# EAGLE board circadian rev2.0 (EAGLE 9.5.1), part 1 of 2
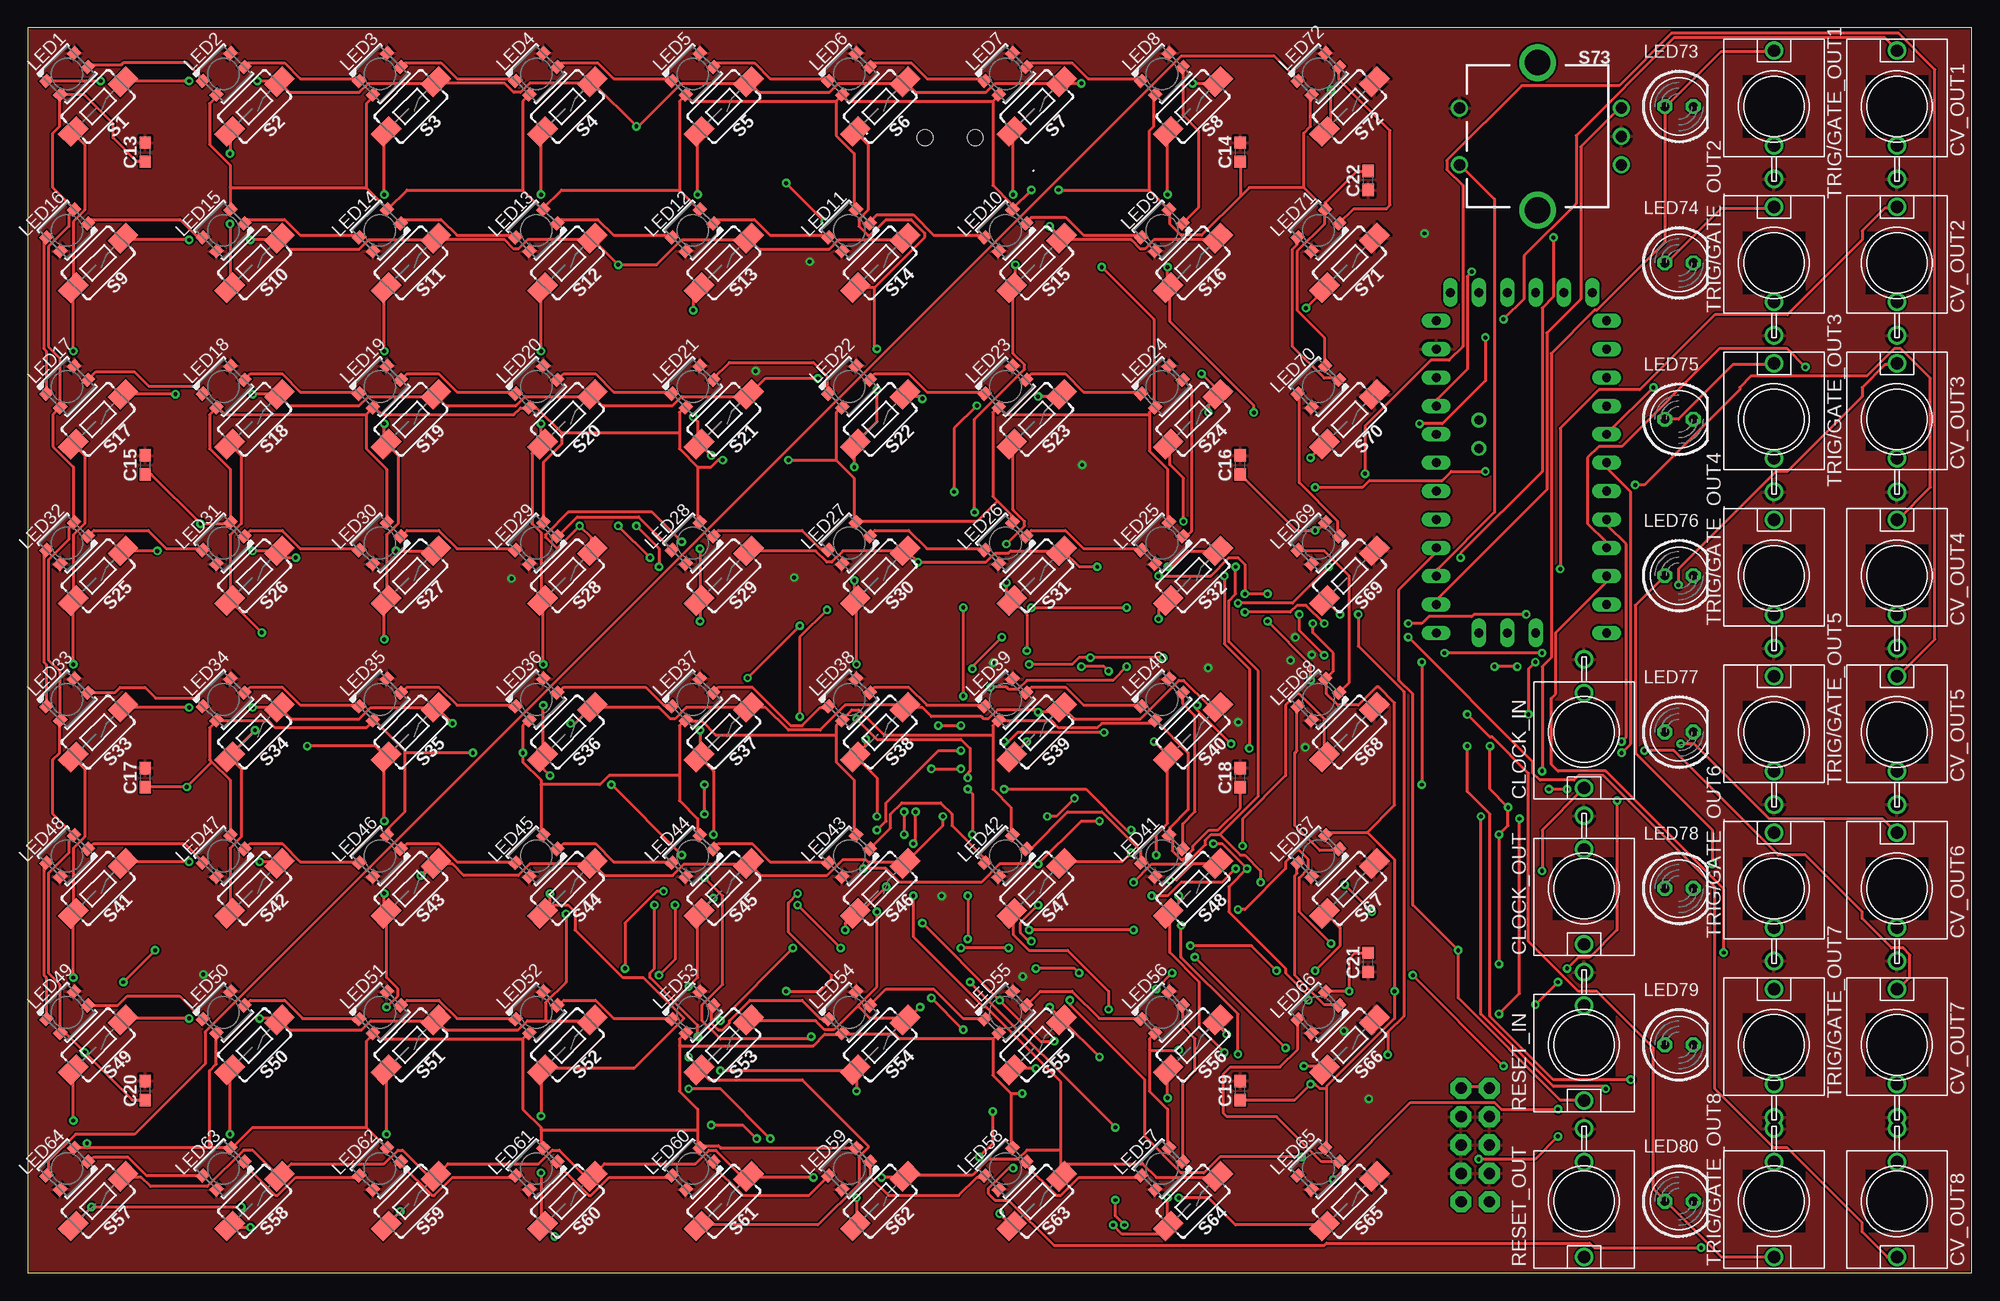
[diagram p6: board, top side]
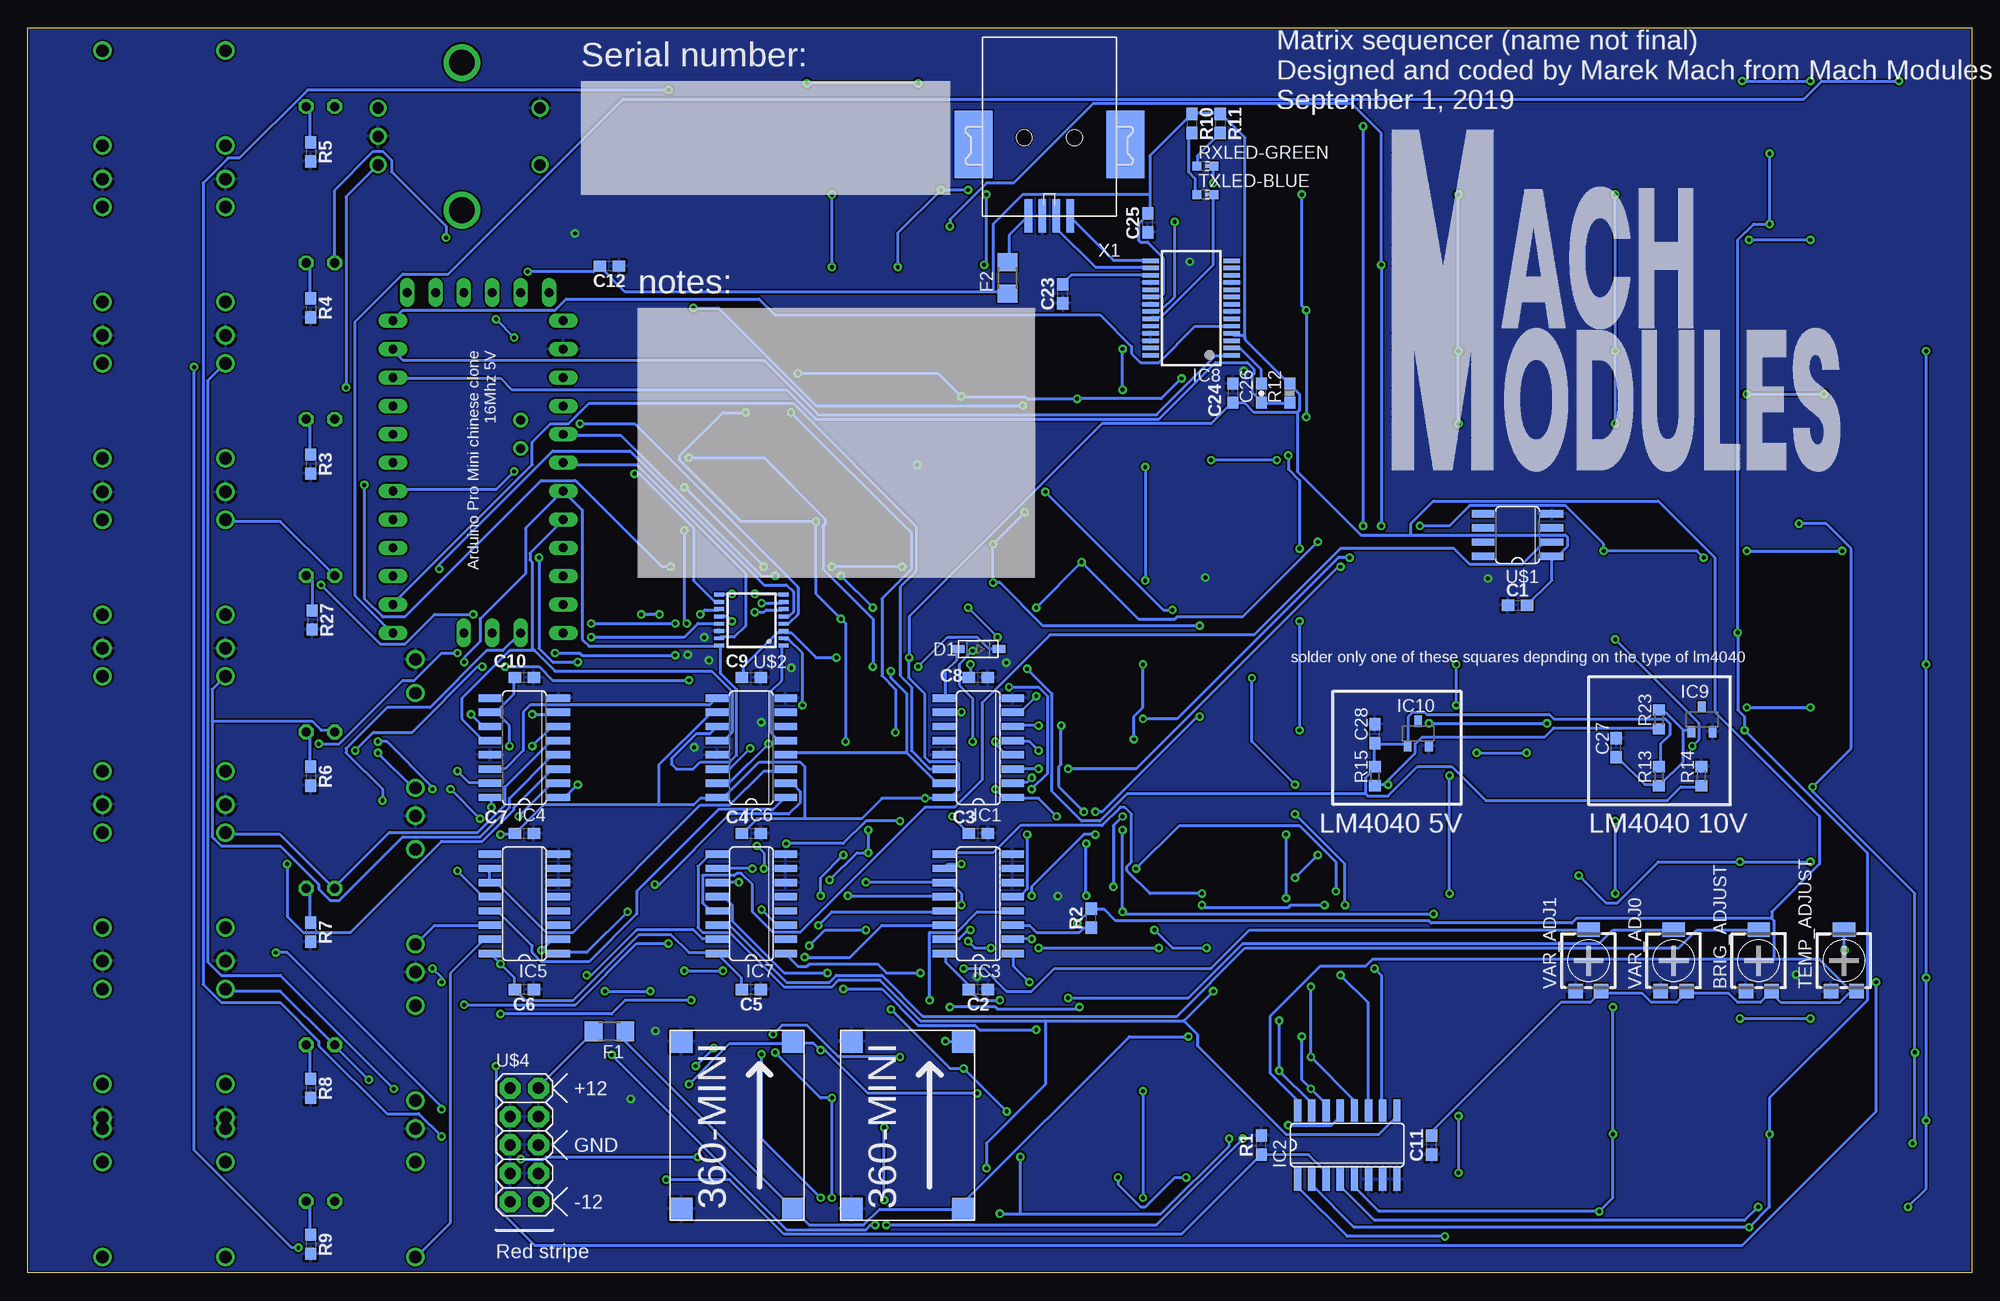
[diagram p7: board, bottom side, seen from below]

Size 173.97 x 111.43 mm. Coordinates in mm from the lower left corner, seen from the top.
Outline: 0,0 173.97,0 173.97,111.43 0,111.43 0,0
Copper layers (1*16): Top 0.035mm / dielectric 0.15mm / Bottom 0.035mm
Design rules "default *": minimum track width 6mil, minimum drill 0.35mm, track to track 6mil, track to pad 6mil, pad to pad 6mil, via to via 6mil, smd to smd 6mil, copper to edge 6mil, drill to drill 6mil, minimum pad ring 10mil, minimum via ring 8mil, stop-mask expansion 4mil, vias tented up to drill 50mil, thermal gap 10mil
Net classes: 0 default: width 0.254 mm; 1 LED_POWER: width 0.305 mm

## Footprints (pad centres in the part's own frame; a part is rotated, then mirrored left to right if it is on the bottom)
RTRIM4G/J = smd 1.3 x 1.3: 1 -1.15,-2.75; 3 1.15,-2.75 | smd 2 x 1.3: 2 0,2.75
0603 = smd 1.1 x 1: 1 -0.85,0; 2 0.85,0
0603-CAP = smd 1.1 x 1: 1 -0.85,0; 2 0.85,0
C0603 = smd 1.1 x 1: 1 -0.85,0; 2 0.85,0
WQP-PJ301M-12_JACK = drill 1.1: P$1 0,5; P$2 0,-3.5; P$3 0,-6.5
SOD-123 = smd 1.2 x 0.7: A 1.85,0; C -1.85,0
1206 = smd 1.6 x 1.803: 1 -1.422,0; 2 1.422,0
SO16 = smd 0.66 x 2.032: 1 -4.445,-3.073; 2 -3.175,-3.073; 3 -1.905,-3.073; 4 -0.635,-3.073; 5 0.635,-3.073; 6 1.905,-3.073; 7 3.175,-3.073; 8 4.445,-3.073; 9 4.445,3.073; 10 3.175,3.073; 11 1.905,3.073; 12 0.635,3.073; 13 -0.635,3.073; 14 -1.905,3.073; 15 -3.175,3.073; 16 -4.445,3.073
SSOP28 = smd 0.4 x 1.5: 1 -4.225,-3.625; 2 -3.575,-3.625; 3 -2.925,-3.625; 4 -2.275,-3.625; 5 -1.625,-3.625; 6 -0.975,-3.625; 7 -0.325,-3.625; 8 0.325,-3.625; 9 0.975,-3.625; 10 1.625,-3.625; 11 2.275,-3.625; 12 2.925,-3.625; 13 3.575,-3.625; 14 4.225,-3.625; 15 4.225,3.625; 16 3.575,3.625; 17 2.925,3.625; 18 2.275,3.625; 19 1.625,3.625; 20 0.975,3.625; 21 0.325,3.625; 22 -0.325,3.625; 23 -0.975,3.625; 24 -1.625,3.625; 25 -2.275,3.625; 26 -2.925,3.625; 27 -3.575,3.625; 28 -4.225,3.625
DBZ_R-PDSO-G3 = smd 0.7 x 1: 1 -0.95,-1.1; 2 0.95,-1.1; 3 0,1.1
LED3535 = smd 1 x 0.85: 1 -1.75,0.875; 2 -1.75,-0.875; 3 1.75,-0.875; 4 1.75,0.875
LED5MM = drill 0.813 octagon: A -1.27,0; K 1.27,0
0603-RES = smd 1.1 x 1: 1 -0.85,0; 2 0.85,0
R0603 = smd 1 x 1.1: 1 -0.85,0; 2 0.85,0
CHIP-LED0603 = smd 0.8 x 0.8: A 0,-0.75; C 0,0.75
TACTILE_SWITCH_SMD_6.0X3.5MM = smd 2.3 x 1.6: 1 -3.15,0; 2 3.15,0
ROTARY_ENC_PLAIN = drill 1.016: A 7.493,-2.54; B 7.493,2.54; C 7.493,0; SW+ -6.985,2.54; SW- -6.985,-2.54 | drill 2.286: P$3 0,6.604; P$4 0,-6.604
SO08 = smd 0.66 x 2.032: 1 -1.905,-3.073; 2 -0.635,-3.073; 3 0.635,-3.073; 4 1.905,-3.073; 5 1.905,3.073; 6 0.635,3.073; 7 -0.635,3.073; 8 -1.905,3.073
TSSOP-16 = smd 0.9 x 0.35: 1 -2.875,2.275; 2 -2.875,1.625; 3 -2.875,0.975; 4 -2.875,0.325; 5 -2.875,-0.325; 6 -2.875,-0.975; 7 -2.875,-1.625; 8 -2.875,-2.275; 9 2.875,-2.275; 10 2.875,-1.625; 11 2.875,-0.975; 12 2.875,-0.325; 13 2.875,0.325; 14 2.875,0.975; 15 2.875,1.625; 16 2.875,2.275
ABK-PRO-MINI = drill 0.8 long: A0 10.16,-11.43; A1 10.16,-8.89; A2 10.16,-6.35; A3 10.16,-3.81; A6 3.81,-21.59; A7 6.35,-21.59; D2 -5.08,-3.81; D3 -5.08,-6.35; D4 -5.08,-8.89; D5 -5.08,-11.43; D6 -5.08,-13.97; D7 -5.08,-16.51; D8 -5.08,-19.05; D9 -5.08,-21.59; D10 10.16,-21.59; D11 10.16,-19.05; D12 10.16,-16.51; D13 10.16,-13.97; DTR -3.81,8.89; GND 10.16,3.81; GND1 -5.08,-1.27; GND2 8.89,8.89; GND3 6.35,8.89; GND4 1.27,-21.59; RAW 10.16,6.35; RST 10.16,1.27; RST1 -5.08,1.27; RX1 -5.08,3.81; RX1-1 1.27,8.89; TX0 -5.08,6.35; TX0-1 -1.27,8.89; VCC 10.16,-1.27; VCC1 3.81,8.89 | drill 0.8: A4 6.35,-5.08; A5 6.35,-2.54
POWER_10 = drill 1.016 pad 1.88 octagon: 1 -5.08,-1.27; 2 -5.08,1.27; 3 -2.54,-1.27; 4 -2.54,1.27; 5 0,-1.27; 6 0,1.27; 7 2.54,-1.27; 8 2.54,1.27; 9 5.08,-1.27; 10 5.08,1.27
MINI-360SMD = smd 2 x 2: +IN -7,-5; +OUT 8,-5; -IN -7,5; -OUT 8,5
USB-B-SMT = smd 6.04 x 3.4: 5 0.58,6.8; 6 0.58,-6.8 | smd 3 x 0.7: D+ 7,1.875; D- 7,0.625; GND 7,-0.625; VUSB 7,-1.875 | hole 1.4: 0,2.25; 0,-2.25

## Placement (x,y rotation side)
BRIG_ADJUST  [RTRIM4G/J]  19.05,27.94 0 bottom
C1  0.1uF  [0603]  40.64,59.75 0 bottom
C2  0.1uF  [0603]  88.9,25.34 180 bottom
C3  0.1uF  [0603]  88.9,39.31 180 bottom
C4  0.1uF  [0603]  109.22,39.31 180 bottom
C5  0.1uF  [0603]  109.22,25.34 180 bottom
C6  0.1uF  [0603]  129.54,25.34 180 bottom
C7  0.1uF  [0603]  129.54,39.31 180 bottom
C8  0.1uF  [0603]  88.9,53.28 180 bottom
C9  0.1uF  [0603]  109.22,53.28 180 bottom
C10  0.1uF  [0603]  129.54,53.28 180 bottom
C11  0.1uF  [0603]  48.32,11.43 90 bottom
C12  0.1uF  [0603]  121.92,90.11 180 bottom
C13  0.1uF  [0603]  10.51,100.31 90 top
C14  0.1uF  [0603]  108.51,100.31 90 top
C15  0.1uF  [0603]  10.51,72.31 90 top
C16  0.1uF  [0603]  108.51,72.31 90 top
C17  0.1uF  [0603]  10.51,44.31 90 top
C18  0.1uF  [0603]  108.51,44.31 90 top
C19  0.1uF  [0603]  108.51,16.31 90 top
C20  0.1uF  [0603]  10.51,16.31 90 top
C21  0.1uF  [0603]  119.97,27.77 90 top
C22  0.1uF  [0603]  119.97,97.77 90 top
C23  0.1uF  [0603]  81.34,87.63 90 bottom
C24  10uF  [0603]  66.1,78.74 90 bottom
C25  0.1uF  [0603]  73.72,93.98 90 bottom
C26  100n  [0603-CAP]  63.56,78.74 90 bottom
C27  470n  [C0603]  31.81,46.99 90 bottom
C28  470n  [C0603]  53.4,48.26 90 bottom
CLOCK_IN  WQP-PJ301M-12_JACK  [WQP-PJ301M-12_JACK]  139.28,48.4 180 top
CLOCK_OUT  WQP-PJ301M-12_JACK  [WQP-PJ301M-12_JACK]  139.28,34.4 180 top
CV_OUT1  WQP-PJ301M-12_JACK  [WQP-PJ301M-12_JACK]  167.29,104.4 0 top
CV_OUT2  WQP-PJ301M-12_JACK  [WQP-PJ301M-12_JACK]  167.29,90.4 0 top
CV_OUT3  WQP-PJ301M-12_JACK  [WQP-PJ301M-12_JACK]  167.29,76.4 0 top
CV_OUT4  WQP-PJ301M-12_JACK  [WQP-PJ301M-12_JACK]  167.29,62.4 0 top
CV_OUT5  WQP-PJ301M-12_JACK  [WQP-PJ301M-12_JACK]  167.29,48.4 0 top
CV_OUT6  WQP-PJ301M-12_JACK  [WQP-PJ301M-12_JACK]  167.29,34.4 0 top
CV_OUT7  WQP-PJ301M-12_JACK  [WQP-PJ301M-12_JACK]  167.29,20.4 0 top
CV_OUT8  WQP-PJ301M-12_JACK  [WQP-PJ301M-12_JACK]  167.29,6.4 180 top
D1  [SOD-123]  88.9,55.82 180 bottom
F1  PTC-FUSE  [1206]  121.92,21.59 180 bottom
F2  PTC-FUSE  [1206]  86.3,89.05 90 bottom
IC1  4017D  [SO16]  88.9,46.99 90 bottom
IC2  4051D  [SO16]  55.88,11.43 0 bottom
IC3  4051D  [SO16]  88.9,33.02 90 bottom
IC4  74HC595D  [SO16]  129.54,46.99 90 bottom
IC5  4053D  [SO16]  129.54,33.02 90 bottom
IC6  74HC595D  [SO16]  109.22,46.99 90 bottom
IC7  4051D  [SO16]  109.22,33.02 90 bottom
IC8  FT232RL  [SSOP28]  69.85,86.36 90 bottom
IC9  LM4040B10  [DBZ_R-PDSO-G3]  24.13,49.53 0 bottom
IC10  LM4040B05  [DBZ_R-PDSO-G3]  49.53,48.26 0 bottom
LED1  WS2812B3535  [LED3535]  3.51,107.31 45 top
LED2  WS2812B3535  [LED3535]  17.51,107.31 45 top
LED3  WS2812B3535  [LED3535]  31.51,107.31 45 top
LED4  WS2812B3535  [LED3535]  45.51,107.31 45 top
LED5  WS2812B3535  [LED3535]  59.51,107.31 45 top
LED6  WS2812B3535  [LED3535]  73.51,107.31 45 top
LED7  WS2812B3535  [LED3535]  87.51,107.31 45 top
LED8  WS2812B3535  [LED3535]  101.51,107.31 45 top
LED9  WS2812B3535  [LED3535]  101.51,93.31 225 top
LED10  WS2812B3535  [LED3535]  87.51,93.31 225 top
LED11  WS2812B3535  [LED3535]  73.51,93.31 225 top
LED12  WS2812B3535  [LED3535]  59.51,93.31 225 top
LED13  WS2812B3535  [LED3535]  45.51,93.31 225 top
LED14  WS2812B3535  [LED3535]  31.51,93.31 225 top
LED15  WS2812B3535  [LED3535]  17.51,93.31 225 top
LED16  WS2812B3535  [LED3535]  3.51,93.31 225 top
LED17  WS2812B3535  [LED3535]  3.51,79.31 45 top
LED18  WS2812B3535  [LED3535]  17.51,79.31 45 top
LED19  WS2812B3535  [LED3535]  31.51,79.31 45 top
LED20  WS2812B3535  [LED3535]  45.51,79.31 45 top
LED21  WS2812B3535  [LED3535]  59.51,79.31 45 top
LED22  WS2812B3535  [LED3535]  73.51,79.31 45 top
LED23  WS2812B3535  [LED3535]  87.51,79.31 45 top
LED24  WS2812B3535  [LED3535]  101.51,79.31 45 top
LED25  WS2812B3535  [LED3535]  101.51,65.31 225 top
LED26  WS2812B3535  [LED3535]  87.51,65.31 225 top
LED27  WS2812B3535  [LED3535]  73.51,65.31 225 top
LED28  WS2812B3535  [LED3535]  59.51,65.31 225 top
LED29  WS2812B3535  [LED3535]  45.51,65.31 225 top
LED30  WS2812B3535  [LED3535]  31.51,65.31 225 top
LED31  WS2812B3535  [LED3535]  17.51,65.31 225 top
LED32  WS2812B3535  [LED3535]  3.51,65.31 225 top
LED33  WS2812B3535  [LED3535]  3.51,51.31 45 top
LED34  WS2812B3535  [LED3535]  17.51,51.31 45 top
LED35  WS2812B3535  [LED3535]  31.51,51.31 45 top
LED36  WS2812B3535  [LED3535]  45.51,51.31 45 top
LED37  WS2812B3535  [LED3535]  59.51,51.31 45 top
LED38  WS2812B3535  [LED3535]  73.51,51.31 45 top
LED39  WS2812B3535  [LED3535]  87.51,51.31 45 top
LED40  WS2812B3535  [LED3535]  101.51,51.31 45 top
LED41  WS2812B3535  [LED3535]  101.51,37.31 225 top
LED42  WS2812B3535  [LED3535]  87.51,37.31 225 top
LED43  WS2812B3535  [LED3535]  73.51,37.31 225 top
LED44  WS2812B3535  [LED3535]  59.51,37.31 225 top
LED45  WS2812B3535  [LED3535]  45.51,37.31 225 top
LED46  WS2812B3535  [LED3535]  31.51,37.31 225 top
LED47  WS2812B3535  [LED3535]  17.51,37.31 225 top
LED48  WS2812B3535  [LED3535]  3.51,37.31 225 top
LED49  WS2812B3535  [LED3535]  3.51,23.31 45 top
LED50  WS2812B3535  [LED3535]  17.51,23.31 45 top
LED51  WS2812B3535  [LED3535]  31.51,23.31 45 top
LED52  WS2812B3535  [LED3535]  45.51,23.31 45 top
LED53  WS2812B3535  [LED3535]  59.51,23.31 45 top
LED54  WS2812B3535  [LED3535]  73.51,23.31 45 top
LED55  WS2812B3535  [LED3535]  87.51,23.31 45 top
LED56  WS2812B3535  [LED3535]  101.51,23.31 45 top
LED57  WS2812B3535  [LED3535]  101.51,9.31 225 top
LED58  WS2812B3535  [LED3535]  87.51,9.31 225 top
LED59  WS2812B3535  [LED3535]  73.51,9.31 225 top
LED60  WS2812B3535  [LED3535]  59.51,9.31 225 top
LED61  WS2812B3535  [LED3535]  45.51,9.31 225 top
LED62  WS2812B3535  [LED3535]  31.51,9.31 225 top
LED63  WS2812B3535  [LED3535]  17.51,9.31 225 top
LED64  WS2812B3535  [LED3535]  3.51,9.31 225 top
LED65  WS2812B3535  [LED3535]  115.51,9.31 225 top
LED66  WS2812B3535  [LED3535]  115.51,23.31 225 top
LED67  WS2812B3535  [LED3535]  115.51,37.31 225 top
LED68  WS2812B3535  [LED3535]  115.51,51.31 225 top
LED69  WS2812B3535  [LED3535]  115.51,65.31 225 top
LED70  WS2812B3535  [LED3535]  115.51,79.31 225 top
LED71  WS2812B3535  [LED3535]  115.51,93.31 225 top
LED72  WS2812B3535  [LED3535]  115.51,107.31 45 top
LED73  [LED5MM]  147.79,104.4 0 top
LED74  [LED5MM]  147.79,90.4 0 top
LED75  [LED5MM]  147.79,76.4 0 top
LED76  [LED5MM]  147.79,62.4 0 top
LED77  [LED5MM]  147.79,48.4 0 top
LED78  [LED5MM]  147.79,34.4 0 top
LED79  [LED5MM]  147.79,20.4 0 top
LED80  [LED5MM]  147.79,6.4 0 top
R1  10k  [0603]  63.56,11.43 90 bottom
R2  10k  [0603]  78.8,31.75 90 bottom
R3  470  [0603]  148.65,72.39 270 bottom
R4  470  [0603]  148.65,86.36 270 bottom
R5  470  [0603]  148.65,100.33 270 bottom
R6  470  [0603]  148.65,44.45 270 bottom
R7  470  [0603]  148.65,30.48 270 bottom
R8  470  [0603]  148.65,16.51 270 bottom
R9  470  [0603]  148.65,2.54 270 bottom
R10  470  [0603]  69.79,102.87 270 bottom
R11  470  [0603]  67.25,102.87 270 bottom
R12  10K  [0603-RES]  61.02,78.74 90 bottom
R13  1.0k  [R0603]  28,44.45 90 bottom
R14  1.0k  [R0603]  24.19,44.45 90 bottom
R15  1.0k  [R0603]  53.4,44.45 90 bottom
R23  1.0k  [R0603]  28,49.53 90 bottom
R27  470  [0603]  148.53,58.42 270 bottom
RESET_IN  WQP-PJ301M-12_JACK  [WQP-PJ301M-12_JACK]  139.28,20.4 180 top
RESET_OUT  WQP-PJ301M-12_JACK  [WQP-PJ301M-12_JACK]  139.28,6.4 180 top
RXLED-GREEN  [CHIP-LED0603]  68.58,99.06 270 bottom
S1  MOMENTARY-SWITCH-SPST-SMD-6.0X3.5MM  [TACTILE_SWITCH_SMD_6.0X3.5MM]  6.29,104.4 225 top
S2  MOMENTARY-SWITCH-SPST-SMD-6.0X3.5MM  [TACTILE_SWITCH_SMD_6.0X3.5MM]  20.29,104.4 225 top
S3  MOMENTARY-SWITCH-SPST-SMD-6.0X3.5MM  [TACTILE_SWITCH_SMD_6.0X3.5MM]  34.29,104.4 225 top
S4  MOMENTARY-SWITCH-SPST-SMD-6.0X3.5MM  [TACTILE_SWITCH_SMD_6.0X3.5MM]  48.29,104.4 225 top
S5  MOMENTARY-SWITCH-SPST-SMD-6.0X3.5MM  [TACTILE_SWITCH_SMD_6.0X3.5MM]  62.29,104.4 225 top
S6  MOMENTARY-SWITCH-SPST-SMD-6.0X3.5MM  [TACTILE_SWITCH_SMD_6.0X3.5MM]  76.29,104.4 225 top
S7  MOMENTARY-SWITCH-SPST-SMD-6.0X3.5MM  [TACTILE_SWITCH_SMD_6.0X3.5MM]  90.29,104.4 225 top
S8  MOMENTARY-SWITCH-SPST-SMD-6.0X3.5MM  [TACTILE_SWITCH_SMD_6.0X3.5MM]  104.29,104.4 225 top
S9  MOMENTARY-SWITCH-SPST-SMD-6.0X3.5MM  [TACTILE_SWITCH_SMD_6.0X3.5MM]  6.29,90.4 225 top
S10  MOMENTARY-SWITCH-SPST-SMD-6.0X3.5MM  [TACTILE_SWITCH_SMD_6.0X3.5MM]  20.29,90.4 225 top
S11  MOMENTARY-SWITCH-SPST-SMD-6.0X3.5MM  [TACTILE_SWITCH_SMD_6.0X3.5MM]  34.29,90.4 225 top
S12  MOMENTARY-SWITCH-SPST-SMD-6.0X3.5MM  [TACTILE_SWITCH_SMD_6.0X3.5MM]  48.29,90.4 225 top
S13  MOMENTARY-SWITCH-SPST-SMD-6.0X3.5MM  [TACTILE_SWITCH_SMD_6.0X3.5MM]  62.29,90.4 225 top
S14  MOMENTARY-SWITCH-SPST-SMD-6.0X3.5MM  [TACTILE_SWITCH_SMD_6.0X3.5MM]  76.29,90.4 225 top
S15  MOMENTARY-SWITCH-SPST-SMD-6.0X3.5MM  [TACTILE_SWITCH_SMD_6.0X3.5MM]  90.29,90.4 225 top
S16  MOMENTARY-SWITCH-SPST-SMD-6.0X3.5MM  [TACTILE_SWITCH_SMD_6.0X3.5MM]  104.29,90.4 225 top
S17  MOMENTARY-SWITCH-SPST-SMD-6.0X3.5MM  [TACTILE_SWITCH_SMD_6.0X3.5MM]  6.29,76.4 225 top
S18  MOMENTARY-SWITCH-SPST-SMD-6.0X3.5MM  [TACTILE_SWITCH_SMD_6.0X3.5MM]  20.29,76.4 225 top
S19  MOMENTARY-SWITCH-SPST-SMD-6.0X3.5MM  [TACTILE_SWITCH_SMD_6.0X3.5MM]  34.29,76.4 225 top
S20  MOMENTARY-SWITCH-SPST-SMD-6.0X3.5MM  [TACTILE_SWITCH_SMD_6.0X3.5MM]  48.29,76.4 225 top
S21  MOMENTARY-SWITCH-SPST-SMD-6.0X3.5MM  [TACTILE_SWITCH_SMD_6.0X3.5MM]  62.29,76.4 225 top
S22  MOMENTARY-SWITCH-SPST-SMD-6.0X3.5MM  [TACTILE_SWITCH_SMD_6.0X3.5MM]  76.29,76.4 225 top
S23  MOMENTARY-SWITCH-SPST-SMD-6.0X3.5MM  [TACTILE_SWITCH_SMD_6.0X3.5MM]  90.29,76.4 225 top
S24  MOMENTARY-SWITCH-SPST-SMD-6.0X3.5MM  [TACTILE_SWITCH_SMD_6.0X3.5MM]  104.29,76.4 225 top
S25  MOMENTARY-SWITCH-SPST-SMD-6.0X3.5MM  [TACTILE_SWITCH_SMD_6.0X3.5MM]  6.29,62.4 225 top
S26  MOMENTARY-SWITCH-SPST-SMD-6.0X3.5MM  [TACTILE_SWITCH_SMD_6.0X3.5MM]  20.29,62.4 225 top
S27  MOMENTARY-SWITCH-SPST-SMD-6.0X3.5MM  [TACTILE_SWITCH_SMD_6.0X3.5MM]  34.29,62.4 225 top
S28  MOMENTARY-SWITCH-SPST-SMD-6.0X3.5MM  [TACTILE_SWITCH_SMD_6.0X3.5MM]  48.29,62.4 225 top
S29  MOMENTARY-SWITCH-SPST-SMD-6.0X3.5MM  [TACTILE_SWITCH_SMD_6.0X3.5MM]  62.29,62.4 225 top
S30  MOMENTARY-SWITCH-SPST-SMD-6.0X3.5MM  [TACTILE_SWITCH_SMD_6.0X3.5MM]  76.29,62.4 225 top
S31  MOMENTARY-SWITCH-SPST-SMD-6.0X3.5MM  [TACTILE_SWITCH_SMD_6.0X3.5MM]  90.29,62.4 225 top
S32  MOMENTARY-SWITCH-SPST-SMD-6.0X3.5MM  [TACTILE_SWITCH_SMD_6.0X3.5MM]  104.29,62.4 225 top
S33  MOMENTARY-SWITCH-SPST-SMD-6.0X3.5MM  [TACTILE_SWITCH_SMD_6.0X3.5MM]  6.29,48.4 225 top
S34  MOMENTARY-SWITCH-SPST-SMD-6.0X3.5MM  [TACTILE_SWITCH_SMD_6.0X3.5MM]  20.29,48.4 225 top
S35  MOMENTARY-SWITCH-SPST-SMD-6.0X3.5MM  [TACTILE_SWITCH_SMD_6.0X3.5MM]  34.29,48.4 225 top
S36  MOMENTARY-SWITCH-SPST-SMD-6.0X3.5MM  [TACTILE_SWITCH_SMD_6.0X3.5MM]  48.29,48.4 225 top
S37  MOMENTARY-SWITCH-SPST-SMD-6.0X3.5MM  [TACTILE_SWITCH_SMD_6.0X3.5MM]  62.29,48.4 225 top
S38  MOMENTARY-SWITCH-SPST-SMD-6.0X3.5MM  [TACTILE_SWITCH_SMD_6.0X3.5MM]  76.29,48.4 225 top
S39  MOMENTARY-SWITCH-SPST-SMD-6.0X3.5MM  [TACTILE_SWITCH_SMD_6.0X3.5MM]  90.29,48.4 225 top
S40  MOMENTARY-SWITCH-SPST-SMD-6.0X3.5MM  [TACTILE_SWITCH_SMD_6.0X3.5MM]  104.29,48.4 225 top
S41  MOMENTARY-SWITCH-SPST-SMD-6.0X3.5MM  [TACTILE_SWITCH_SMD_6.0X3.5MM]  6.29,34.4 225 top
S42  MOMENTARY-SWITCH-SPST-SMD-6.0X3.5MM  [TACTILE_SWITCH_SMD_6.0X3.5MM]  20.29,34.4 225 top
S43  MOMENTARY-SWITCH-SPST-SMD-6.0X3.5MM  [TACTILE_SWITCH_SMD_6.0X3.5MM]  34.29,34.4 225 top
S44  MOMENTARY-SWITCH-SPST-SMD-6.0X3.5MM  [TACTILE_SWITCH_SMD_6.0X3.5MM]  48.29,34.4 225 top
S45  MOMENTARY-SWITCH-SPST-SMD-6.0X3.5MM  [TACTILE_SWITCH_SMD_6.0X3.5MM]  62.29,34.4 225 top
S46  MOMENTARY-SWITCH-SPST-SMD-6.0X3.5MM  [TACTILE_SWITCH_SMD_6.0X3.5MM]  76.29,34.4 225 top
S47  MOMENTARY-SWITCH-SPST-SMD-6.0X3.5MM  [TACTILE_SWITCH_SMD_6.0X3.5MM]  90.29,34.4 225 top
S48  MOMENTARY-SWITCH-SPST-SMD-6.0X3.5MM  [TACTILE_SWITCH_SMD_6.0X3.5MM]  104.29,34.4 225 top
S49  MOMENTARY-SWITCH-SPST-SMD-6.0X3.5MM  [TACTILE_SWITCH_SMD_6.0X3.5MM]  6.29,20.4 225 top
S50  MOMENTARY-SWITCH-SPST-SMD-6.0X3.5MM  [TACTILE_SWITCH_SMD_6.0X3.5MM]  20.29,20.4 225 top
S51  MOMENTARY-SWITCH-SPST-SMD-6.0X3.5MM  [TACTILE_SWITCH_SMD_6.0X3.5MM]  34.29,20.4 225 top
S52  MOMENTARY-SWITCH-SPST-SMD-6.0X3.5MM  [TACTILE_SWITCH_SMD_6.0X3.5MM]  48.29,20.4 225 top
S53  MOMENTARY-SWITCH-SPST-SMD-6.0X3.5MM  [TACTILE_SWITCH_SMD_6.0X3.5MM]  62.29,20.4 225 top
S54  MOMENTARY-SWITCH-SPST-SMD-6.0X3.5MM  [TACTILE_SWITCH_SMD_6.0X3.5MM]  76.29,20.4 225 top
S55  MOMENTARY-SWITCH-SPST-SMD-6.0X3.5MM  [TACTILE_SWITCH_SMD_6.0X3.5MM]  90.29,20.4 225 top
S56  MOMENTARY-SWITCH-SPST-SMD-6.0X3.5MM  [TACTILE_SWITCH_SMD_6.0X3.5MM]  104.29,20.4 225 top
S57  MOMENTARY-SWITCH-SPST-SMD-6.0X3.5MM  [TACTILE_SWITCH_SMD_6.0X3.5MM]  6.29,6.4 225 top
S58  MOMENTARY-SWITCH-SPST-SMD-6.0X3.5MM  [TACTILE_SWITCH_SMD_6.0X3.5MM]  20.29,6.4 225 top
S59  MOMENTARY-SWITCH-SPST-SMD-6.0X3.5MM  [TACTILE_SWITCH_SMD_6.0X3.5MM]  34.29,6.4 225 top
S60  MOMENTARY-SWITCH-SPST-SMD-6.0X3.5MM  [TACTILE_SWITCH_SMD_6.0X3.5MM]  48.29,6.4 225 top
S61  MOMENTARY-SWITCH-SPST-SMD-6.0X3.5MM  [TACTILE_SWITCH_SMD_6.0X3.5MM]  62.29,6.4 225 top
S62  MOMENTARY-SWITCH-SPST-SMD-6.0X3.5MM  [TACTILE_SWITCH_SMD_6.0X3.5MM]  76.29,6.4 225 top
S63  MOMENTARY-SWITCH-SPST-SMD-6.0X3.5MM  [TACTILE_SWITCH_SMD_6.0X3.5MM]  90.29,6.4 225 top
S64  MOMENTARY-SWITCH-SPST-SMD-6.0X3.5MM  [TACTILE_SWITCH_SMD_6.0X3.5MM]  104.29,6.4 225 top
S65  MOMENTARY-SWITCH-SPST-SMD-6.0X3.5MM  [TACTILE_SWITCH_SMD_6.0X3.5MM]  118.29,6.4 225 top
S66  MOMENTARY-SWITCH-SPST-SMD-6.0X3.5MM  [TACTILE_SWITCH_SMD_6.0X3.5MM]  118.29,20.4 225 top
S67  MOMENTARY-SWITCH-SPST-SMD-6.0X3.5MM  [TACTILE_SWITCH_SMD_6.0X3.5MM]  118.29,34.4 225 top
S68  MOMENTARY-SWITCH-SPST-SMD-6.0X3.5MM  [TACTILE_SWITCH_SMD_6.0X3.5MM]  118.29,48.4 225 top
S69  MOMENTARY-SWITCH-SPST-SMD-6.0X3.5MM  [TACTILE_SWITCH_SMD_6.0X3.5MM]  118.29,62.4 225 top
S70  MOMENTARY-SWITCH-SPST-SMD-6.0X3.5MM  [TACTILE_SWITCH_SMD_6.0X3.5MM]  118.29,76.4 225 top
S71  MOMENTARY-SWITCH-SPST-SMD-6.0X3.5MM  [TACTILE_SWITCH_SMD_6.0X3.5MM]  118.29,90.4 225 top
S72  MOMENTARY-SWITCH-SPST-SMD-6.0X3.5MM  [TACTILE_SWITCH_SMD_6.0X3.5MM]  118.29,104.4 225 top
S73  ENCODER-SWITCH  [ROTARY_ENC_PLAIN]  135.13,101.72 0 top
TEMP_ADJUST  [RTRIM4G/J]  11.43,27.94 0 bottom
TRIG/GATE_OUT1  WQP-PJ301M-12_JACK  [WQP-PJ301M-12_JACK]  156.29,104.4 0 top
TRIG/GATE_OUT2  WQP-PJ301M-12_JACK  [WQP-PJ301M-12_JACK]  156.29,90.4 0 top
TRIG/GATE_OUT3  WQP-PJ301M-12_JACK  [WQP-PJ301M-12_JACK]  156.29,76.4 0 top
TRIG/GATE_OUT4  WQP-PJ301M-12_JACK  [WQP-PJ301M-12_JACK]  156.29,62.4 0 top
TRIG/GATE_OUT5  WQP-PJ301M-12_JACK  [WQP-PJ301M-12_JACK]  156.29,48.4 0 top
TRIG/GATE_OUT6  WQP-PJ301M-12_JACK  [WQP-PJ301M-12_JACK]  156.29,34.4 0 top
TRIG/GATE_OUT7  WQP-PJ301M-12_JACK  [WQP-PJ301M-12_JACK]  156.29,20.4 0 top
TRIG/GATE_OUT8  WQP-PJ301M-12_JACK  [WQP-PJ301M-12_JACK]  156.29,6.4 180 top
TXLED-BLUE  [CHIP-LED0603]  68.58,96.52 270 bottom
U$1  AD22100  [SO08]  40.64,66.04 90 bottom
U$2  AD5328  [TSSOP-16]  109.22,58.42 180 bottom
U$3  ABK-PRO-MINI  [ABK-PRO-MINI]  136.22,78.86 0 bottom
U$4  POWER_SIMPLE10  [POWER_10]  129.54,11.43 90 bottom
U$5  MINI-360SMD  [MINI-360SMD]  110.49,12.7 90 bottom
U$6  MINI-360SMD  [MINI-360SMD]  95.25,12.7 90 bottom
VAR_ADJ0  [RTRIM4G/J]  26.67,27.94 0 bottom
VAR_ADJ1  [RTRIM4G/J]  34.29,27.94 0 bottom
X1  [USB-B-SMT]  82.55,101.6 270 bottom

## Tracks (layer width: path | path; a pad name or v marks a point on that pad's centre or on a via)
5V_REF  (via drill 0.35)
  Top 0.254: v110.95,60.76 v108.92,60.76 108.92,63.4 108.31,64.01 107.49,64.01 105.87,62.38 v101.19,62.38 | v89.81,59.54 v98.35,59.54 | v87.17,56.9 84.53,54.25 v84.53,54.05
  Bottom 0.254: R13.2 27.84,45.31 27.84,47.35 27.03,48.16 27.03,49.17 27.43,49.58 37.39,49.58 37.8,49.99 48.77,49.99 48.97,50.19 49.99,50.19 50.39,49.78 50.39,47.35 IC10.1 50.6,47.35 53.24,47.35 C28.1 53.44,47.35 53.44,45.31 R15.2 53.44,45.11 54.25,44.3 54.25,42.88 | v108.92,60.76 106.48,60.76 U$2.8 | v110.95,60.76 111.96,60.76 U$2.9 | 54.25,42.88 54.05,42.67 52.22,42.67 49.58,45.31 46.53,45.31 43.48,42.27 27.23,42.27 26.01,43.48 24.38,43.48 R14.1 | v98.35,59.54 v101.19,62.38 | v87.17,56.9 v89.81,59.54 | v84.53,54.05 82.3,51.82 82.3,43.08 79.65,40.44 78.03,40.44 75.59,42.88 54.25,42.88
+5V  (via drill 0.35)
  Top 0.254: v80.06,31.29 v86.97,24.38 90.63,20.73 v91.85,20.73 | v89.61,54.46 93.47,54.46 94.08,55.07 v95.1,55.07 v101.6,55.07 | v91.24,40.84 92.05,40.84 v93.67,42.47 | v130.86,47.14 130.86,43.28 v132.49,41.66 132.49,40.03 v131.67,39.22 v131.67,27.64 | v129.24,89.61 128.83,89.2 128.83,80.87 126.19,78.23 126.19,77.62 U$3.VCC
  Bottom 0.254: C11.2 48.16,12.39 48.16,12.8 36.78,24.18 34.14,24.18 33.33,24.99 VAR_ADJ1.3 33.12,24.99 29.46,24.99 28.65,24.18 26.42,24.18 25.6,24.99 VAR_ADJ0.3 25.4,24.99 21.74,24.99 20.93,24.18 18.9,24.18 18.09,24.99 BRIG_ADJUST.3 17.88,24.99 17.07,24.18 11.79,24.18 10.97,24.99 10.57,24.99 | IC3.16 91.85,28.45 91.85,27.84 89.81,25.81 89.81,25.4 C2.2 89.61,25.2 88.8,24.38 v86.97,24.38 | v80.06,31.29 78.84,32.51 R2.2 78.64,32.51 77.62,32.51 76.61,31.5 48.56,31.5 48.36,31.29 35.76,31.29 35.36,31.7 17.88,31.7 | v91.85,20.73 90.42,20.73 U$6.+OUT | 10.57,24.99 10.36,24.99 TEMP_ADJUST.3 10.57,24.99 | 17.68,28.04 13.61,28.04 10.57,24.99 | 17.68,28.04 53.65,28.04 54.25,27.43 58.32,27.43 62.79,22.96 62.79,17.88 60.35,15.44 60.35,14.63 IC2.16 | 17.88,31.7 17.68,31.5 17.68,28.04 | C5.2 110.13,25.4 110.13,26.42 IC7.16 112.37,28.65 114.81,28.65 116.43,30.28 119.28,30.28 125.17,24.38 129.44,24.38 130.25,25.2 C6.2 130.45,25.4 130.45,26.42 v131.67,27.64 IC5.16 | C9.2 109.93,53.44 109.93,54.25 106.88,57.3 106.48,57.3 U$2.3 106.27,57.3 105.66,57.3 103.43,55.07 v101.6,55.07 | v89.61,54.46 89.61,53.44 C8.2 | v91.24,40.84 89.81,39.42 C3.2 | 104.44,40.64 99.36,40.64 97.54,42.47 v93.67,42.47 92.05,42.47 IC1.16 91.85,42.67 91.24,42.67 90.63,43.28 90.63,45.52 90.83,45.72 93.27,45.72 93.67,46.13 93.67,51.82 95.1,53.24 v95.1,55.07 95.1,58.73 77.83,76 68.07,76 66.24,77.83 C24.1 66.04,77.83 65.02,77.83 64.21,77.01 60.35,77.01 | 104.44,40.64 108.71,40.64 109.93,39.42 C4.2 | 132.08,50.19 130.45,51.82 130.45,53.24 C10.2 | 132.08,50.19 132.49,50.19 IC4.10 132.08,50.19
  Bottom 0.254: 117.52,41.86 114.4,41.86 113.79,42.47 112.37,42.47 IC6.16 112.17,42.67 111.56,42.67 108.51,45.72 104.85,45.72 104.44,45.31 104.44,40.64 | 117.52,41.86 127.81,41.86 130.25,39.42 C7.2 130.45,39.22 v131.67,39.22 | v132.49,41.66 132.49,42.47 IC4.16 | IC6.10 112.37,49.99 112.98,49.99 117.52,45.45 117.52,41.86 | 132.08,50.19 130.86,48.97 v130.86,47.14 | 87.58,87.78 86.36,87.78 F2.1 | 87.58,87.78 120.5,87.78 122.73,90.02 C12.2 122.94,90.02 123.34,89.61 v129.24,89.61 | 73.56,96.52 73.56,99.97 69.9,103.63 R10.1 69.7,103.83 67.26,103.83 R11.1 67.06,103.63 65.02,101.6 65.02,83.72 | 73.56,96.52 73.56,94.89 C25.2 73.76,94.69 74.57,93.88 74.57,92.46 74.37,92.25 73.76,92.25 72.34,90.83 72.34,87.58 72.54,87.38 73.36,87.38 IC8.20 | 65.02,83.72 65.02,83.52 61.16,79.65 R12.2 60.96,79.45 60.15,78.64 60.15,77.22 60.35,77.01 | 65.02,83.72 65.23,83.92 66.04,83.92 IC8.4 | 50.19,66.04 54.66,66.04 60.35,71.73 60.35,77.01 | 50.19,66.04 36.37,66.04 36.17,65.84 36.17,65.02 36.98,64.21 37.39,64.21 U$1.1 37.57,61.97 C1.2 | 87.58,87.78 87.58,93.88 84.94,96.52 73.56,96.52 | 17.88,31.7 17.88,32.31 13.61,36.58 13.61,40.84 22.96,50.19 22.96,64.01 28.04,69.09 48.16,69.09 50.19,67.06 50.19,66.04
+12V  (via drill 0.35)
  Top 0.254: v58.52,37.39 v52.22,43.69 | v60.55,35.36 62.18,33.73 62.18,25.81 60.35,23.98 60.35,22.55 61.98,20.93 69.9,20.93 v70.1,21.13
  Bottom 0.254: 52.43,43.89 52.63,43.69 53.24,43.69 R15.1 | 52.43,43.89 49.78,46.53 49.78,47.35 49.17,47.95 38.2,47.95 37.39,48.77 28.04,48.77 R23.1 | F1.1 120.5,21.54 120.5,20.73 105.66,5.89 U$5.+IN 105.46,5.69 104.04,4.27 99.16,4.27 97.74,5.69 90.42,5.69 U$6.+IN 90.22,5.89 90.22,6.3 75.39,21.13 v70.1,21.13 | v52.22,43.69 52.43,43.89 | v60.55,35.36 v58.52,37.39
ANALOG_MUX  (via drill 0.35)
  Top 0.254: v108.31,32.51 108.92,32.51 112.57,36.17 112.57,36.78 113.59,37.8 113.79,37.8 114.61,36.98 114.61,36.17 113.79,35.36 113.79,32.31 v116.64,29.46 | v136.96,26.01 v134.93,23.98 | v137.77,27.23 138.79,28.25 139.8,28.25 142.24,30.68 v142.24,42.27
  Bottom 0.254: v108.31,32.51 107.09,31.29 106.27,31.29 IC7.3 | v116.64,29.46 119.48,29.46 124.97,23.98 v134.93,23.98 | v136.96,26.01 136.96,26.42 v137.77,27.23 | v142.24,42.27 142.24,43.28 145.49,46.53 145.49,46.94 141.83,50.6 137.97,50.6 132.89,55.68 131.47,55.68 130.05,57.1 U$3.A7
AREF
  Bottom 0.254: 25.81,48.56 25.2,48.56 IC9.1 | 25.81,48.56 27.43,50.19 27.84,50.19 R23.2 | C27.1 31.7,46.13 29.26,43.69 28.04,43.69 R13.1 27.84,43.69 25.81,45.72 25.81,48.56
BRIGHTNESS_ADJ
  Bottom 0.254: BRIG_ADJUST.2 19.1,30.68 24.59,30.68 26.21,29.06 65.02,29.06 71.12,22.96 93.88,22.96 97.54,26.62 101.6,26.62 102.21,26.01 106.07,26.01 111.15,31.09 112.17,31.09 IC7.14
BUTTON_CONTROL_OUT
  Bottom 0.254: R2.1 78.84,30.89 79.45,30.89 79.86,30.48 83.72,30.48 84.33,31.09 85.75,31.09 IC3.3
BUTTON_MATRIX_COLLUM1  (via drill 0.35)
  Top 0.254: S1.2 4.06,102.01 5.08,100.99 5.08,95.1 4.06,94.08 4.06,88.19 S9.2 4.06,87.99 v4.06,82.5 | S17.2 5.08,73.15 5.08,67.06 4.06,66.04 4.06,60.35 S25.2 4.06,60.15 v4.06,54.46 | S33.2 4.06,46.13 5.08,45.11 5.08,39.01 4.06,38 4.06,32.31 S41.2 4.06,32.11 v4.06,26.42 | v19.1,5.89 v5.69,5.89 4.06,4.27 S57.2 | v4.06,13.61 4.06,18.09 S49.2
  Bottom 0.254: v19.1,5.89 20.32,4.67 53.44,4.67 56.49,7.72 56.49,8.33 IC2.4 | v5.69,5.89 4.06,7.52 v4.06,13.61 v4.06,26.42 v4.06,54.46 v4.06,82.5
BUTTON_MATRIX_COLLUM2  (via drill 0.35)
  Top 0.254: v19.91,4.06 18.09,4.06 S58.2 | v18.09,12.39 18.09,18.09 S50.2 | v18.09,93.88 18.09,88.19 S10.2 | v18.09,100.18 18.09,102.01 S2.2 | S42.2 18.09,32.31 18.09,38 19.1,39.01 19.1,45.11 18.09,46.13 S34.2 18.09,46.33 v20.32,48.56 | S18.2 18.09,74.17 19.1,73.15 19.1,67.06 18.09,66.04 18.09,60.35 S26.2 18.09,60.15 v20.93,57.3
  Bottom 0.254: IC2.2 58.93,8.33 58.93,7.72 55.27,4.06 v19.91,4.06 18.09,5.89 v18.09,12.39 18.09,15.65 9.35,24.38 9.35,37.59 v20.32,48.56 20.32,49.78 20.93,50.39 v20.93,57.3 20.93,92.46 19.51,93.88 v18.09,93.88 v18.09,100.18
BUTTON_MATRIX_COLLUM3  (via drill 0.35)
  Top 0.254: v31.9,82.5 31.9,87.99 S11.2 | v31.9,76 31.9,74.37 S19.2 32.11,74.17 33.12,73.15 33.12,67.06 32.11,66.04 32.11,60.35 S27.2 31.9,60.15 v31.9,56.69 | v31.9,96.52 31.9,102.01 S3.2 | v33.33,5.49 32.11,4.27 S59.2 | v32.11,12.39 32.11,18.09 S51.2 | v32.11,23.77 33.12,24.79 33.12,25.4 32.11,26.42 32.11,32.11 S43.2 31.9,32.31 v31.9,33.93 | v31.9,40.44 31.9,46.13 S35.2 31.9,46.33 31.09,47.14 v24.99,47.14
  Bottom 0.254: v31.9,76 v31.9,82.5 v31.9,96.52 | IC2.5 55.07,8.33 55.07,7.52 53.03,5.49 v33.33,5.49 32.11,6.71 v32.11,12.39 v32.11,23.77 | v31.9,33.93 v31.9,40.44 | v31.9,56.69 24.38,49.17 24.38,47.75 v24.99,47.14
BUTTON_MATRIX_COLLUM4  (via drill 0.35)
  Top 0.254: v45.92,82.5 45.92,87.99 S12.2 | v45.92,76 45.92,74.37 S20.2 45.92,74.17 45.11,73.36 45.11,67.06 45.92,66.24 45.92,60.35 S28.2 46.13,60.15 v46.13,54.46 | v45.92,96.52 45.92,102.01 S4.2 | v47.14,3.25 46.13,4.27 S60.2 45.92,4.27 v45.92,8.94 | 46.74,32.92 48.36,32.92 48.97,32.31 48.97,30.68 53.24,26.42 55.07,26.42 58.73,22.76 54.25,18.29 46.13,18.29 S52.2 45.92,18.09 v45.92,14.02 | 46.74,32.92 46.13,32.31 S44.2 46.74,32.92 | v46.74,44.5 46.13,45.11 46.13,46.13 S36.2 46.13,46.33 v46.13,50.8 | 46.74,32.92 v46.74,33.93
  Bottom 0.254: v45.92,76 v45.92,82.5 v45.92,96.52 | v47.14,3.25 55.88,3.25 60.15,7.52 60.15,8.33 IC2.1 | v46.74,33.93 v46.74,44.5 | v45.92,14.02 v45.92,8.94 | v46.13,50.8 v46.13,54.46
BUTTON_MATRIX_COLLUM5  (via drill 0.35)
  Top 0.254: v59.13,19.3 60.15,18.29 S53.2 60.15,18.09 60.96,17.27 69.29,17.27 75.18,11.38 75.18,11.18 74.37,10.36 74.37,7.92 70.71,4.27 60.15,4.27 S61.2 | v59.13,25.6 59.94,26.42 59.94,32.11 S45.2 60.15,32.31 v61.37,33.53 | v60.15,48.56 60.15,46.33 S37.2 60.15,46.13 61.37,44.91 v61.37,39.22 | v60.15,58.32 60.15,60.15 S29.2 60.15,60.35 v60.15,64.82 | v59.54,76.61 59.94,76.2 59.94,74.37 S21.2 60.15,74.17 v61.16,73.15 | v59.54,86.16 59.54,87.58 59.94,87.99 S13.2 | v59.94,96.52 59.94,102.01 S5.2
  Bottom 0.254: IC2.12 55.27,14.63 55.27,15.44 v59.13,19.3 v59.13,25.6 | v60.15,58.32 v60.15,48.56 | v59.54,76.61 v59.54,86.16 59.94,86.56 v59.94,96.52 | v60.15,64.82 60.15,70.92 61.16,71.93 v61.16,73.15 | v61.37,39.22 v61.37,33.53
BUTTON_MATRIX_COLLUM6  (via drill 0.35)
  Top 0.254: v61.98,18.09 73.97,18.09 S54.2 74.17,18.09 v74.17,16.26 | v74.17,6.71 74.17,4.27 S62.2 | 75.79,88.19 74.17,88.19 S14.2 | 75.79,88.19 80.26,92.66 80.26,93.07 79.05,94.28 76.81,94.28 75.39,92.86 75.18,92.86 74.37,93.67 74.37,94.28 75.18,95.1 75.18,100.99 74.17,102.01 S6.2 | v73.97,61.98 73.97,60.35 S30.2 74.17,60.15 v74.17,54.46 | v73.97,72.14 73.97,74.17 S22.2 74.17,74.37 76,76.2 v76,79.05 | v76.81,34.54 74.57,32.31 74.17,32.31 S46.2 73.97,32.11 73.15,31.29 v73.15,30.68 | v76,40.84 76,44.3 74.17,46.13 S38.2 74.17,46.33 74.98,47.14 v74.98,47.75 | 75.79,88.19 75.79,82.91 v76,82.7 | v68.48,29.06 v61.98,22.55
  Bottom 0.254: IC2.15 59.13,14.63 59.13,15.24 v61.98,18.09 v61.98,22.55 | v74.17,16.26 v74.17,6.71 | v73.97,72.14 v73.97,61.98 | v76.81,34.54 76.81,40.03 v76,40.84 | v74.17,54.46 74.17,50.6 74.98,49.78 v74.98,47.75 | v76,79.05 v76,82.7 | v68.48,29.06 71.53,29.06 v73.15,30.68
BUTTON_MATRIX_COLLUM7  (via drill 0.35)
  Top 0.254: v89.41,47.55 88.19,46.33 S39.2 | v89.41,55.68 89.41,58.93 88.19,60.15 S31.2 87.99,60.35 87.58,60.76 v87.58,61.77 | v87.58,65.23 89.2,66.85 89.2,67.26 88.19,68.28 88.19,74.17 S23.2 | v84.73,68.07 84.73,76.4 89.2,80.87 89.2,81.28 88.19,82.3 88.19,87.99 S15.2 88.19,88.19 88.39,88.39 v88.39,90.22 | v88.19,96.52 88.19,102.01 S7.2 | v90.22,18.29 88.19,18.29 S55.2 | v96.72,23.57 96.72,25.2 93.07,28.85 89.61,28.85 88.19,30.28 88.19,32.11 S47.2 | v59.13,16.46 61.98,16.46 v66.45,11.99 | v86.97,5.28 87.99,4.27 S63.2 | v86.36,14.43 86.36,11.58 v85.14,10.36 | v64.41,53.24 v69.09,57.91 | v60.55,41.05 v60.55,43.69 | v56.08,32.92 56.08,27.23 55.68,26.82 55.68,26.42 59.94,22.15 v59.94,21.13
  Bottom 0.254: v89.41,47.55 89.41,51.41 90.63,52.63 90.63,54.46 v89.41,55.68 | v84.73,68.07 v87.58,65.23 v87.58,61.77 86.97,61.77 83.11,57.91 v69.09,57.91 | v88.19,96.52 88.19,90.42 v88.39,90.22 | v96.72,23.57 91.44,18.29 v90.22,18.29 v86.36,14.43 | v66.45,11.99 66.45,11.38 72.54,5.28 85.14,5.28 | v86.97,5.28 85.14,5.28 | IC2.14 57.91,14.63 57.91,15.24 v59.13,16.46 59.94,17.27 v59.94,21.13 | 85.14,5.28 v85.14,10.36 | v64.41,53.24 64.41,47.55 v60.55,43.69 | v60.55,41.05 56.08,36.58 v56.08,32.92
BUTTON_MATRIX_COLLUM8  (via drill 0.35)
  Top 0.254: v100.79,47.55 102.01,46.33 S40.2 102.01,46.13 102.01,40.23 100.99,39.22 v100.99,37.39 | v101.19,58.52 101.19,59.33 102.01,60.15 S32.2 | v103.43,67.26 103.43,71.12 102.21,72.34 102.21,74.17 S24.2 | v109.73,77.01 109.73,77.62 102.21,85.14 102.21,87.99 S16.2 102.01,88.19 v102.01,90.02 | v102.01,96.52 102.01,102.01 S8.2 | v61.16,13.21 64.01,13.21 v65.23,11.99 | v97.13,4.27 97.94,3.45 101.4,3.45 102.01,4.06 S64.2 102.01,4.27 v102.01,6.71 | v102.01,15.65 102.01,18.09 S56.2 | v107.09,19.71 104.85,21.95 104.85,26.01 102.21,28.65 102.21,32.11 S48.2 102.21,32.31 103.02,33.12 v103.02,33.73
  Bottom 0.254: v100.79,47.55 100.79,58.12 v101.19,58.52 103.43,60.76 v103.43,67.26 110.13,67.26 115.62,72.75 115.62,73.15 111.76,77.01 v109.73,77.01 | v102.01,90.02 v102.01,96.52 | v61.16,13.21 57.3,13.21 56.69,13.82 56.69,14.43 IC2.13 | v65.23,11.99 72.95,4.27 v97.13,4.27 | v102.01,6.71 v102.01,15.65 103.02,15.65 v107.09,19.71 | v100.99,37.39 103.02,35.36 v103.02,33.73
BUTTON_MATRIX_OUT  (via drill 0.35)
  Top 0.254: v151.79,28.65 151.79,34.34 141.22,44.91 136.96,44.91 136.35,45.52 136.35,51.41 136.75,51.82 136.75,57.3 141.22,61.77 141.22,62.18 U$3.D7 | v136.96,14.63 131.88,14.63 131.27,15.24 123.75,15.24 v116.84,8.33
  Bottom 0.254: IC2.3 57.91,8.53 57.91,9.14 59.33,10.57 63.4,10.57 R1.1 63.6,10.57 70.71,3.45 106.27,3.45 111.15,8.33 v116.84,8.33 | v151.79,28.65 150.77,28.65 136.96,14.83 v136.96,14.63
BUTTON_MATRIX_ROW1  (via drill 0.35)
  Top 0.254: v14.43,106.68 8.53,106.68 S1.1 | v20.52,106.68 22.35,106.68 S2.1 22.55,106.48 23.37,105.66 29.67,105.66 30.48,106.48 36.37,106.48 S3.1 36.58,106.48 42.67,106.48 43.48,105.66 44.09,105.66 44.91,106.48 50.39,106.48 S4.1 50.6,106.48 v54.46,102.62 54.66,102.62 58.52,106.48 64.41,106.48 S5.1 64.62,106.48 65.43,105.66 71.73,105.66 72.54,106.48 78.44,106.48 S6.1 78.64,106.48 79.45,105.66 85.75,105.66 86.56,106.48 92.46,106.48 S7.1 92.66,106.48 v94.28,106.48 | v80.87,45.11 v83.52,45.11 | v56.49,63.2 56.49,64.82 v54.46,66.85 | v104.24,106.48 106.48,106.48 S8.1
  Bottom 0.254: v20.52,106.68 v14.43,106.68 | v83.52,45.11 85.75,45.11 IC1.3 | v80.87,45.11 74.78,45.11 56.69,63.2 v56.49,63.2 | v54.46,102.62 v54.46,66.85 | v94.28,106.48 v104.24,106.48
BUTTON_MATRIX_ROW2  (via drill 0.35)
  Top 0.254: v14.43,92.46 8.53,92.46 S9.1 | v19.91,92.46 22.35,92.46 S10.1 22.55,92.46 23.37,91.64 29.67,91.64 30.48,92.46 36.37,92.46 S11.1 36.58,92.46 42.67,92.46 43.48,91.64 43.89,91.64 44.7,92.46 50.39,92.46 S12.1 50.6,92.46 v52.83,90.22 56.29,90.22 58.52,92.46 64.41,92.46 S13.1 64.62,92.46 65.43,91.64 71.73,91.64 72.54,92.46 78.44,92.46 S14.1 | S16.1 106.48,92.46 100.79,92.46 99.97,91.64 99.57,91.64 98.75,92.46 92.66,92.46 S15.1 92.46,92.66 v91.44,93.67 | v84.12,44.3 84.12,44.7 84.33,44.91 84.33,46.94 83.52,47.75 76,47.75 v74.17,49.58 | v52.83,66.85 v55.68,64.01
  Bottom 0.254: v19.91,92.46 v14.43,92.46 | v84.12,44.3 84.53,43.89 85.75,43.89 IC1.2 | v74.17,49.58 71.12,49.58 56.69,64.01 v55.68,64.01 | v52.83,66.85 v52.83,90.22 52.83,102.01 55.47,104.65 78.64,104.65 85.75,97.54 88.19,97.54 91.44,94.28 v91.44,93.67
BUTTON_MATRIX_ROW3  (via drill 0.35)
  Top 0.254: v87.38,47.55 87.78,47.55 88.59,48.36 v96.32,48.36 | v105.66,77.01 105.66,77.62 106.48,78.44 S24.1 106.48,78.64 106.48,79.05 v105.05,80.47 | v80.06,78.23 79.86,78.44 78.64,78.44 S22.1 | v90.42,78.44 92.46,78.44 S23.1 | v13.21,78.64 8.53,78.64 S17.1 | v20.12,78.64 22.35,78.64 S18.1 22.55,78.44 23.37,77.62 29.67,77.62 30.48,78.44 36.37,78.44 S19.1 36.58,78.44 37.39,77.62 43.69,77.62 44.5,78.44 50.39,78.44 S20.1 50.6,78.44 51.41,77.62 57.71,77.62 58.52,78.44 64.41,78.44 S21.1 64.62,78.64 66.04,80.06 v70.71,80.06
  Bottom 0.254: v87.38,47.55 87.38,47.35 86.56,46.53 85.95,46.53 IC1.4 | v96.32,48.36 96.32,52.22 97.54,53.44 97.54,60.35 94.89,62.99 94.89,66.24 v105.66,77.01 | v20.12,78.64 v13.21,78.64 | v70.71,80.06 72.54,78.23 v80.06,78.23 84.53,78.23 84.73,78.44 v90.42,78.44 92.46,80.47 v105.05,80.47
BUTTON_MATRIX_ROW4  (via drill 0.35)
  Top 0.254: v11.58,64.62 8.53,64.62 S25.1 | v20.12,64.62 22.35,64.62 S26.1 22.55,64.62 23.16,64.01 v23.98,64.01 | v32.92,64.62 36.37,64.62 S27.1 | S28.1 50.39,64.82 50.39,65.84 v49.38,66.85 47.35,64.82 46.33,65.84 46.33,66.04 48.36,68.07 55.88,68.07 v58.52,65.43 | v83.72,59.54 v83.72,51.61 | S29.1 64.62,64.62 70.51,64.62 71.53,63.6 71.93,63.6 72.95,64.62 78.44,64.62 S30.1 78.64,64.62 v79.65,63.6 85.75,63.6 86.56,64.41 87.78,64.41 87.99,64.62 92.46,64.62 S31.1 92.66,64.62 94.08,63.2 v95.71,63.2 | v102.01,63.2 102.41,63.2 103.83,64.62 106.48,64.62 S32.1
  Bottom 0.254: v20.12,64.62 v11.58,64.62 | v23.98,64.01 24.59,64.62 v32.92,64.62 32.92,65.23 36.37,68.68 44.91,68.68 46.74,66.85 v49.38,66.85 | v83.72,51.61 85.14,50.19 85.75,50.19 IC1.7 | v83.72,59.54 v79.65,63.6 74.57,58.52 71.32,58.52 71.12,58.73 65.23,58.73 v58.52,65.43 | v95.71,63.2 v102.01,63.2
BUTTON_MATRIX_ROW5  (via drill 0.35)
  Top 0.254: v14.43,50.6 8.53,50.6 S33.1 | v20.12,50.6 22.35,50.6 S34.1 22.55,50.6 23.57,49.58 29.67,49.58 30.68,50.6 36.37,50.6 S35.1 36.58,50.6 v38,49.17 | S40.1 106.48,50.8 105.66,50.8 103.43,53.03 103.02,53.03 99.57,49.58 93.67,49.58 92.66,50.6 S39.1 92.46,50.6 92.05,50.19 v90.42,50.19 90.22,50.39 86.77,50.39 85.95,49.58 85.55,49.58 85.34,49.78 80.87,49.78 80.06,50.6 78.64,50.6 S38.1 78.44,50.8 73.15,50.8 70.92,48.56 68.07,48.56 66.04,50.6 64.62,50.6 S37.1 64.41,50.6 58.93,50.6 57.91,49.58 57.51,49.58 56.49,50.6 50.6,50.6 S36.1 50.39,50.6 48.97,49.17 v48.56,49.17
  Bottom 0.254: v20.12,50.6 v14.43,50.6 | v90.42,50.19 91.85,50.19 IC1.10 | v48.56,49.17 v38,49.17
BUTTON_MATRIX_ROW6  (via drill 0.35)
  Top 0.254: v98.75,37.59 97.94,36.78 92.66,36.78 S47.1 | v102.21,35.15 102.82,35.15 104.24,36.58 106.48,36.58 S48.1 | v14.43,36.78 8.53,36.78 S41.1 | v20.73,36.78 22.35,36.78 S42.1 | v81.89,40.84 81.89,40.03 78.64,36.78 S46.1 78.44,36.78 75.18,36.78 74.98,36.98 72.95,36.98 71.53,35.56 65.63,35.56 64.62,36.58 S45.1 64.41,36.58 58.73,36.58 57.71,35.56 51.61,35.56 50.6,36.58 S44.1 50.39,36.58 44.91,36.58 43.89,35.56 39.01,35.56 38,36.58 36.58,36.58 S43.1 36.37,36.78 v35.15,35.56 | v98.75,39.62 98.35,39.62 94.69,43.28 v87.38,43.28
  Bottom 0.254: v102.21,35.15 99.77,37.59 v98.75,37.59 v98.75,39.62 | v14.43,36.78 v20.73,36.78 28.04,36.78 31.7,33.12 32.72,33.12 v35.15,35.56 | v81.89,40.84 83.52,42.47 85.75,42.47 IC1.1 85.95,42.67 86.77,42.67 v87.38,43.28
BUTTON_MATRIX_ROW7  (via drill 0.35)
  Top 0.254: v14.43,22.76 8.53,22.76 S49.1 | v20.73,22.76 22.35,22.76 S50.1 22.55,22.55 23.37,21.74 29.87,21.74 30.68,22.55 36.37,22.55 S51.1 36.58,22.55 37.39,21.74 43.89,21.74 44.7,22.55 46.33,22.55 | 46.33,22.55 50.39,22.55 S52.1 | v83.52,46.74 81.48,46.74 76.81,42.06 76.81,40.44 v76,39.62 | v76,32.31 76,25.6 74.37,23.98 | 74.37,23.98 74.37,23.77 75.39,22.76 78.44,22.76 S54.1 78.64,22.55 v79.86,23.77 | 74.37,23.98 72.14,21.74 71.32,21.74 70.51,22.55 64.62,22.55 S53.1 | v91.44,23.77 92.46,22.76 S55.1 92.66,22.55 v95.91,19.3 | v107.29,21.34 106.68,21.95 106.68,22.55 S56.1 | 46.33,22.55 46.33,24.18 48.16,26.01 v48.16,32.11
  Bottom 0.254: v20.73,22.76 v14.43,22.76 | v83.52,46.74 84.33,47.55 85.75,47.55 IC1.5 | v76,39.62 v76,32.31 75.79,32.11 v48.16,32.11 | v91.44,23.77 87.38,23.77 87.17,23.57 80.06,23.57 v79.86,23.77 | v107.29,21.34 106.48,22.15 104.24,22.15 101.4,19.3 v95.91,19.3
BUTTON_MATRIX_ROW8  (via drill 0.35)
  Top 0.254: S57.1 8.53,8.53 10.16,8.53 10.97,7.72 16.05,7.72 19.3,10.97 20.12,10.97 22.35,8.74 S58.1 22.55,8.74 23.57,9.75 31.9,9.75 33.12,10.97 33.53,10.97 35.76,8.74 36.37,8.74 S59.1 36.58,8.74 37.59,9.75 45.72,9.75 46.94,10.97 47.55,10.97 49.78,8.74 50.39,8.74 S60.1 50.6,8.74 51.61,9.75 59.74,9.75 60.96,10.97 61.57,10.97 63.8,8.74 64.41,8.74 S61.1 64.62,8.53 v70.31,8.53 | v81.48,48.97 v83.52,48.97 | v79.45,41.25 79.45,38.61 v79.25,38.41 | v79.25,33.73 79.25,30.07 85.55,23.77 85.75,23.77 92.46,17.07 92.46,10.97 | 92.46,9.75 92.46,8.74 S63.1 | 92.46,9.75 92.46,10.97 | 92.46,10.97 89.41,10.97 88.59,10.16 85.95,10.16 84.53,8.74 78.64,8.74 S62.1 78.44,8.53 v76.4,8.53 | 92.46,9.75 99.77,9.75 100.99,8.53 106.48,8.53 S64.1
  Bottom 0.254: v83.52,48.97 85.75,48.97 IC1.6 | v81.48,48.97 81.48,45.52 81.69,45.31 81.69,43.48 v79.45,41.25 | v79.25,33.73 v79.25,38.41 | v70.31,8.53 71.32,8.53 73.97,5.89 74.37,5.89 76.4,7.92 v76.4,8.53
BUTTON_MATRIX_ROW_CLOCK
  Bottom 0.254: IC1.14 92.05,45.11 93.27,45.11 94.89,46.74 94.89,52.43 95.91,53.44 95.91,61.37 94.49,62.79 94.49,66.85 105.46,77.83 123.75,77.83 125.58,76 127.2,76 128.83,74.37 128.83,72.34 141.22,59.94 U$3.D8
BUTTON_MATRIX_ROW_RESET  (via drill 0.35)
  Top 0.254: v94.28,54.25 96.32,54.25 v96.72,53.85
  Bottom 0.254: v94.28,54.25 91.64,56.9 89,56.9 87.99,55.88 87.17,55.88 D1.C | v96.72,53.85 96.72,53.24 95.3,51.82 95.3,46.53 | 95.3,46.53 92.66,43.89 92.05,43.89 IC1.15 | 95.3,46.53 106.07,46.53 IC6.4
CLOCK_IN  (via drill 0.35)
  Top 0.254: v135.53,35.97 135.53,39.62 139.19,43.28 CLOCK_IN.P$1 | v142.65,46.53 143.46,47.35 143.46,69.9 141.43,71.93 141.43,72.34 U$3.D3
  Bottom 0.254: v135.53,35.97 133.3,33.73 132.69,33.73 IC5.12 | v142.65,46.53 139.4,43.28 CLOCK_IN.P$1
CLOCK_OUT
  Bottom 0.254: IC5.13 132.49,32.31 131.88,32.31 128.83,29.26 128.83,28.65 128.02,27.84 123.75,27.84 119.48,32.11 119.48,34.14 112.17,41.45 107.29,41.45 106.27,42.47 IC6.1
CLOCK_RESET_SWITCH
  Bottom 0.254: IC5.10 132.69,36.17 132.69,34.95 IC5.11 132.49,34.75 131.88,34.75 127.61,30.48 125.17,30.48 113.79,41.86 111.15,41.86 108.1,44.91 106.27,44.91 IC6.3
COMM_A  (via drill 0.35)
  Top 0.254: v56.49,26.62 57.91,28.04 v57.91,32.92 | v72.75,29.06 v68.89,32.92 | v87.78,29.06 v83.52,29.06 | v89.81,29.67 89.61,29.67 88.8,30.48 88.8,31.29 v90.42,32.92 | v110.34,34.95 110.34,35.97 108.92,37.39 108.51,37.39 106.68,39.22 | 106.68,39.22 105.89,39.22 105.4,38.72 105.4,38.32 103.66,36.58 100.58,36.58 v98.96,34.95 | v130.45,71.73 127.41,71.73 126.59,70.92 120.09,70.92 119.48,70.31 v115.21,70.31 | v108.1,63.2 108.1,60.76 107.49,60.15 107.49,56.49 110.13,53.85 110.13,42.67 106.68,39.22
  Bottom 0.254: v56.49,26.62 54.05,24.18 54.05,14.63 IC2.11 | v57.91,32.92 60.96,32.92 61.16,32.72 68.68,32.72 v68.89,32.92 | v83.52,29.06 v72.75,29.06 | v87.78,29.06 89.2,29.06 v89.81,29.67 | v90.42,32.92 90.42,33.93 91.24,34.75 91.85,34.75 IC3.11 92.05,34.95 v98.96,34.95 | v110.34,34.95 112.17,34.95 IC7.11 | v130.45,71.73 132.08,70.1 141.22,70.1 U$3.D4 | v108.1,63.2 v115.21,70.31
COMM_B  (via drill 0.35)
  Top 0.254: v53.44,27.23 53.44,31.29 56.29,34.14 v56.9,34.14 | v74.78,36.17 76.81,36.17 78.03,34.95 85.34,34.95 86.97,36.58 v90.42,36.58 94.28,40.44 v95.91,40.44 | v106.1,38.41 106.88,38.41 v109.12,36.17 107.49,34.54 107.49,32.31 112.57,27.23 112.57,26.82 114.61,24.79 v114.61,24.38 | v142.65,47.55 143.05,47.95 143.05,65.23 141.43,66.85 141.43,67.26 U$3.D5 | v136.14,43.28 v137.77,43.28 | v133.5,40.64 133.5,24.99 v131.67,23.16
  Bottom 0.254: v53.44,27.23 52.83,26.62 52.83,14.63 IC2.10 | v56.9,34.14 56.9,36.78 60.15,40.03 70.92,40.03 v74.78,36.17 | v90.42,36.58 91.64,36.58 91.85,36.37 IC3.10 | v109.12,36.17 112.17,36.17 IC7.10 | v106.1,38.41 100.99,38.41 98.96,40.44 v95.91,40.44 | v142.65,47.55 141.83,47.55 137.77,43.48 v137.77,43.28 | v133.5,40.64 v136.14,43.28 | v131.67,23.16 121.72,23.16 120.5,24.38 v114.61,24.38
COMM_C  (via drill 0.35)
  Top 0.254: v68.89,33.93 68.07,33.12 68.07,30.48 71.93,26.62 71.93,26.21 70.92,25.2 v67.87,25.2 | v159.11,81.08 157.48,82.7 151.38,82.7 142.65,73.97 140.61,73.97 139.6,72.95 139.6,67.06 141.22,65.43 141.22,65.02 U$3.D6 | v149.76,2.23 140.21,2.23 139.8,2.64 116.23,2.64 116.03,2.44 91.85,2.44 87.78,6.5 86.56,6.5 85.95,7.11 85.95,7.52 87.78,9.35 v88.19,9.35
  Bottom 0.254: 70.51,22.55 69.29,21.34 69.29,20.32 61.37,12.39 53.03,12.39 51.61,13.82 51.61,14.43 IC2.9 | 82.91,22.55 94.08,22.55 97.74,26.21 101.4,26.21 102.01,25.6 106.27,25.6 111.15,30.48 113.59,30.48 114,30.89 114,36.37 112.98,37.39 112.37,37.39 IC7.9 | 82.91,22.55 70.51,22.55 | v68.89,33.93 73.56,33.93 75.59,35.97 75.59,36.37 75.18,36.78 75.18,41.05 75.79,41.66 76.2,41.66 77.83,40.03 85.14,40.03 87.58,37.59 91.85,37.59 IC3.9 | 70.51,22.55 v67.87,25.2 | v159.11,81.08 159.11,10.97 150.37,2.23 v149.76,2.23 | v88.19,9.35 88.19,11.58 82.91,16.87 82.91,22.55
DAC_CS  (via drill 0.35)
  Top 0.254: v104.65,50.8 104.65,50.39 v107.7,47.35
  Bottom 0.254: v104.65,50.8 104.65,55.47 105.87,56.69 106.27,56.69 U$2.2 | v107.7,47.35 111.15,43.89 112.17,43.89 IC6.15
DAC_DATA
  Bottom 0.254: U$2.15 111.96,56.9 110.74,56.9 109.73,57.91 109.73,62.59 119.48,72.34 125.98,72.34 U$3.A2
DAC_LDAC
  Bottom 0.254: U$2.1 106.48,56.08 106.48,53.03 107.49,52.02 107.49,48.36 106.88,47.75 106.27,47.75 IC6.5
DTR
  Bottom 0.254: C26.2 63.6,79.65 63.6,80.87 65.43,82.7 66.04,82.7 IC8.2
ENC_A  (via drill 0.35)
  Top 0.254: v145.49,79.25 141.43,75.18 U$3.D2
  Bottom 0.254: v145.49,79.25 145.49,96.32 142.65,99.16 S73.A
ENC_B
  Top 0.254: U$3.D11 126.19,59.94 126.19,60.35 135.94,70.1 135.94,84.12 138.99,87.17 138.99,100.79 142.44,104.24 S73.B
ENC_SWITCH
  Top 0.254: U$3.D12 126.19,62.38 126.19,62.99 131.27,68.07 131.27,96.11 128.22,99.16 S73.SW-
GND  (via drill 0.35)
  other vias: 68.58,62.23 113.02,54.81 114.92,55.32 113.43,56.87 108.35,49.27 105.64,54.15 114.34,47.02 69.96,90.51 65.14,80.72 15.7,26.69 89.05,26.51 117.8,21.64 125,93.04 86.4,54.6 81.78,33.72 43.29,62.14 94.37,72.32 120.02,15.56
  pour Top: 0,111.43 0,0 173.97,0 173.97,111.43
  pour Bottom: 173.97,0 0,0 0,111.43 173.97,111.43
LED_MATRIX_IN  (via drill 0.35)
  Top 0.254: v6.5,106.68 1.83,106.68 LED1.1
  Bottom 0.254: v6.5,106.68 13.41,106.68 15.04,105.05 120.7,105.05 136.35,89.41 140.41,89.41 144.68,85.14 144.68,60.55 141.43,57.3 U$3.D9
LED_MATRIX_OUT
  Top 0.254: LED64.3 1.83,8.74 1.83,9.96 4.27,12.39 9.55,12.39 15.85,18.69 15.85,21.54 103.23,108.92 111.56,108.92 113.59,106.88 LED72.1
LED_POWER  (via drill 0.35)
  Top 0.254: 100.38,76.81 100.38,77.01 100.79,77.42 LED24.2 100.79,77.62 100.79,85.34 v96.11,90.02 | 100.38,76.81 100.38,73.56 102.01,71.93 102.01,67.26 LED25.2 | 72.34,72.75 73.97,71.12 73.97,67.26 LED27.2 74.17,67.26 84.94,67.26 86.77,69.09 | 72.34,72.75 72.34,77.01 72.75,77.42 LED22.2 | 86.77,69.09 86.36,69.49 86.36,77.01 86.77,77.42 LED23.2 86.97,77.42 87.58,76.81 100.38,76.81 | 86.77,69.09 87.99,67.87 87.99,67.26 LED26.2 | 59.94,72.14 59.94,67.26 LED28.2 | 59.94,72.14 58.32,73.76 58.32,75.18 | 58.32,75.18 58.32,77.01 58.73,77.42 LED21.2 | 47.75,75.18 47.75,74.17 46.13,72.54 46.13,67.26 LED29.2 | 47.75,75.18 45.52,77.42 44.91,77.42 LED20.2 44.7,77.42 44.09,77.42 43.48,76.81 31.7,76.81 31.09,77.42 LED19.2 30.89,77.42 30.28,76.81 | 47.75,75.18 58.32,75.18 | 30.28,76.81 30.28,73.76 32.11,71.93 32.11,67.26 LED30.2 | 30.28,76.81 17.68,76.81 17.07,77.42 LED18.2 16.87,77.42 16.26,76.81 16.26,73.76 18.09,71.93 18.09,67.26 LED31.2 18.09,67.06 v15.44,67.06 11.04,71.46 C15.1 | v68.07,72.75 72.34,72.75 | v62.18,72.75 61.77,72.75 61.16,72.14 59.94,72.14 | 100.38,96.93 100.38,102.21 100.79,102.62 100.79,105.26 LED8.2 | 100.38,96.93 102.01,95.3 LED9.2 102.21,95.1 102.21,93.88 103.23,92.86 105.05,92.86 108.51,96.31 | LED70.2 116.03,81.28 116.03,83.72 113.59,86.16 113.59,91.44 116.03,93.88 116.03,95.1 LED71.2 | 114.2,97.13 114.2,102.01 114.81,102.62 114.81,105.26 LED72.2 | 114.2,97.13 116.03,95.3 LED71.2 | 108.51,96.31 109.32,97.13 114.2,97.13 | 86.36,104.85 86.36,97.33 87.99,95.71 87.99,95.3 LED10.2 88.19,95.3 v89.81,96.93 | 86.36,104.85 86.77,105.26 LED7.2 | 72.34,104.85 72.34,101.8 73.97,100.18 73.97,95.3 LED11.2
  Top 0.254: 72.34,104.85 72.75,105.26 LED6.2 72.95,105.26 73.36,104.85 86.36,104.85 | 58.32,96.93 59.94,95.3 LED12.2 | 58.32,96.93 58.32,104.85 58.73,105.26 LED5.2 58.93,105.26 59.33,104.85 72.34,104.85 | 44.3,96.93 45.92,95.3 LED13.2 46.13,95.3 47.75,96.93 58.32,96.93 | 44.3,96.93 44.3,104.85 44.7,105.26 LED4.2 | 30.28,97.13 32.11,95.3 LED14.2 32.31,95.3 33.93,96.93 44.3,96.93 | 30.28,97.13 30.28,104.65 30.89,105.26 LED3.2 | 18.09,97.13 18.09,99.16 16.26,100.99 16.26,104.65 16.87,105.26 LED2.2 | 18.09,97.13 18.09,95.3 LED15.2 | 18.09,97.13 30.28,97.13 | v92.25,96.93 100.38,96.93 | 86.36,48.16 86.36,48.97 86.77,49.38 LED39.2 86.97,49.38 91.64,49.38 92.25,48.77 95.71,48.77 96.11,49.17 100.58,49.17 100.79,49.38 LED40.2 100.99,49.38 103.83,46.53 103.83,41.45 102.21,39.83 102.21,39.22 LED41.2 102.43,38.87 102.43,37.76 103.19,37 103.43,37 104.3,37.87 104.3,38.2 105.72,39.62 106.51,39.62 108.51,41.62 C18.1 | 86.36,48.16 86.36,43.28 87.99,41.66 87.99,39.22 LED42.2 | 16.46,45.72 16.26,45.92 16.26,48.77 16.87,49.38 LED34.2 17.07,49.38 21.54,49.38 22.15,48.77 30.28,48.77 30.89,49.38 LED35.2 31.09,49.38 33.73,46.74 33.73,46.53 | 16.46,45.72 18.09,44.09 18.09,39.22 LED47.2 | 33.73,46.53 33.73,41.25 32.31,39.83 32.31,39.22 LED46.2 | 72.34,48.16 72.34,48.97 72.75,49.38 LED38.2 72.95,49.58 73.76,50.39 74.37,50.39 76.61,48.16 86.36,48.16 | 72.34,48.16 72.34,45.72 73.97,44.09 73.97,39.22 LED43.2 | 45.92,43.69 45.92,44.09 44.3,45.72 v44.3,46.53 44.3,48.97 44.7,49.38 LED36.2 | 45.92,43.69 45.92,39.22 LED45.2 | 58.32,44.5 58.32,48.97 58.73,49.38 LED37.2 58.93,49.38 60.35,49.38 61.57,48.16 72.34,48.16
  Top 0.254: 58.32,44.5 58.32,42.27 59.94,40.64 59.94,39.22 LED44.2 | 45.92,43.69 51.21,43.69 52.02,44.5 58.32,44.5 | v39.83,46.53 33.73,46.53 | 100.38,19.91 100.38,20.93 100.79,21.34 LED56.2 | 100.38,19.91 100.38,16.26 102.01,14.63 102.01,11.18 LED57.2 | 100.38,19.91 v103.02,19.91 | 116.23,16.46 116.23,16.66 122.33,22.76 v122.33,25.2 122.33,36.98 119.89,39.42 | 116.23,16.46 116.23,11.18 LED65.2 | 119.89,39.42 116.43,39.42 116.23,39.22 LED67.2 | LED66.2 116.23,25.2 v118.26,25.2 118.26,28.09 118.79,28.62 C21.2 | 119.89,39.42 122.33,41.86 122.33,51 120.9,52.43 120.7,52.43 119.08,50.8 117.25,50.8 116.23,51.82 116.23,53.03 LED68.2 116.23,53.24 116.84,53.85 116.84,55.47 115.01,57.3 v115.01,58.12 | LED69.2 116.03,67.06 115.42,66.45 v115.21,66.45 113.52,66.45 C16.1 | 116.23,16.46 115.62,16.46 115.21,16.87 v114.81,16.87 113.41,15.46 C19.1 | 86.36,20.93 78.03,20.93 77.62,21.34 72.95,21.34 LED54.2 72.75,21.34 71.32,21.34 70.31,20.32 58.32,20.32 | 86.36,20.93 86.77,21.34 LED55.2 | 87.99,16.05 87.99,11.18 LED58.2 | 87.99,16.05 86.36,17.68 86.36,20.93 | 59.94,12.8 59.94,14.63 58.32,16.26 58.32,20.32 | 59.94,12.8 59.94,11.38 | 59.94,11.38 59.94,11.18 LED60.2 59.94,11.38 | 58.32,20.32 58.32,20.93 58.73,21.34 LED53.2 | 59.94,11.38 61.77,11.38 61.98,11.18 73.97,11.18 LED59.2 | 45.92,12.8 45.92,13.01 44.3,14.63 44.3,20.93 | 45.92,12.8 45.92,11.18 LED61.2 | 44.3,20.93 44.7,21.34 LED52.2 | 30.28,13.01 32.11,11.18 LED62.2 | 30.28,13.01 30.28,20.73 30.89,21.34 LED51.2 31.09,21.34 31.5,20.93 44.3,20.93 | 16.26,11.18 18.09,11.18 LED63.2 18.29,11.18 20.12,13.01 30.28,13.01 | 16.26,11.18 5.28,11.18